# EasyEDA Pro project ProPrj_遥控_2025-12-06.epro, board NRF无线模块
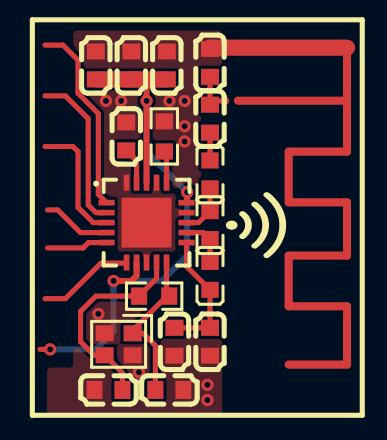
[diagram p7: board, top side]
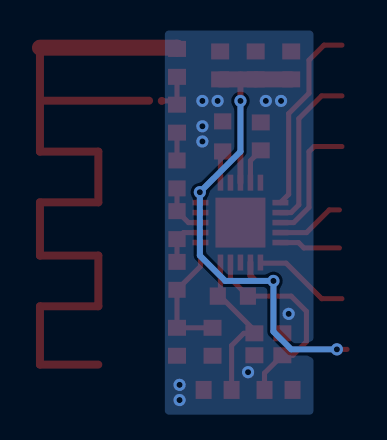
[diagram p8: board, bottom side, seen from below]

No outline. copper layers: Top Layer, Bottom Layer. Coordinates in mm from the lowest, leftmost part position.
Stack: Top Layer 0.035mm / Dielectric1 1.51mm FR4 er 4.5 / Bottom Layer 0.035mm

## Design rules (mm)
template: 用户自定义配置
spacing Default (default): track to track 0.152, other pairs 0 to 0.152
track width Default (default): min 0.254, default 0.254, max 25.4
differential pair differentialPair (default): width min 0.127, default 0.254, max 2.54; gap min 0.152, default 0.152
via Default (default): diameter min 0.61, default 0.61, max 100.025; hole min 0.305, default 0.305, max 59.995
pour e9 uses gge5322
pour e112 uses gge5322(1)

## Placement (name value [footprint] x y rotation side)
C36  22pF  [C0603]  0.63 0 0 top
C37  22pF  [C0603]  3.68 0 180 top
C38  1.5pF  [C0603]  5.72 13.59 90 top
C39  1pF  [C0603]  5.72 16.38 270 top
C40  33nF  [C0603]  1.52 12.7 90 top
C41  100nF  [C0603]  1.78 16.26 270 top
C42  100nF  [C0603]  0 16.26 270 top
C43  1uF  [C0603]  3.56 16.26 270 top
C44  2.2nF  [C0603]  3.94 2.41 90 top
C45  4.7pF  [C0603]  5.72 2.41 90 top
L3  3.9nH  [L0603]  5.72 10.8 90 top
L4  8.2nH  [L0603]  5.72 8.26 270 top
L5  2.7nH  [L0603]  5.72 5.72 270 top
NOREF  -  [Pad_e111]  6.48 14.48 90 top
R41  22kΩ  [R0603]  3.43 12.7 90 top
R42  1MΩ  [R0603]  2.92 4.7 180 top
U13  NRF24L01P-R  [QFN-20_L4.0-W4.0-P0.50-BL-EP]  2.54 8.38 270 top
X1  16MHz  [CRYSTAL-SMD_4P-L2.0-W1.6-BL]  1.14 2.29 180 top

## Footprints (pads in the part's own frame, mm; a bottom-side part is the same pattern mirrored in y, then rotated)
C0603
  rect 0.8x0.9 smd: 1(-0.7,0) 2(0.7,0)
CRYSTAL-SMD_4P-L2.0-W1.6-BL
  rect 0.9x0.8 smd: 1(-0.7,-0.55) 2(0.7,-0.55) 3(0.7,0.55) 4(-0.7,0.55)
L0603
  rect 0.8x0.864 smd: 1(-0.7,0) 2(0.7,0)
Pad_e111
  round 0.4 smd: 2(0,0)
QFN-20_L4.0-W4.0-P0.50-BL-EP
  rect 0.28x0.8 smd: 1(-1,-2) 2(-0.5,-2) 3(0,-2) 4(0.5,-2) 5(1,-2) 11(1,2) 12(0.5,2) 13(0,2) 14(-0.5,2) 15(-1,2)
  rect 0.8x0.28 smd: 6(2,-1) 7(2,-0.5) 8(2,0) 9(2,0.5) 10(2,1) 16(-2,1) 17(-2,0.5) 18(-2,0) 19(-2,-0.5) 20(-2,-1)
  rect 2.5x2.5 smd: 21(0,0)
R0603
  rect 0.806x0.864 smd: 1(-0.753,0) 2(0.753,0)

## Nets
As in the schematic, except:
$1N3907: C38.2 C39.2 NOREF.2

## Via types
v1: diameter 0.61, hole 0.305, Top Layer to Bottom Layer, 14 vias

## Routing (per net, layer and track width the routed paths; a pad name or vN(x,y) marks a point on that pad's centre or on a via; arc(x,y) is an arc through that point)
3V3: length 30.6
  Top Layer w0.254: v1(-2.29,2.03) -2.79,2.03
  Top Layer w0.3: v1(4.57,9.91) 4.57,9.38 4.54,9.38 ; U13.18 v1(2.54,14.48) 2.54,15.56 ; 2.04,6.38 2.04,5.72 1.78,5.46 v1(0.89,5.46)
  Top Layer w0.8: C42.2 C41.2 C43.2
  Bottom Layer w0.3: v1(2.54,14.48) 2.54,11.94 v1(4.57,9.91) 4.57,6.73 3.3,5.46 v1(0.89,5.46) 0.89,2.92 0,2.03 v1(-2.29,2.03)
GND: length 42.9
  Top Layer w0.4: 9.65,1.27 12.57,1.27 12.57,4.19 9.65,4.19 9.65,6.73 12.57,6.73 12.57,9.4 9.65,9.4 9.65,11.94 12.57,11.94 12.57,14.49 ; 12.57,14.49 7.11,14.49 ; 12.57,14.49 12.57,17.15
  Top Layer w0.8: 12.57,17.15 5.72,17.15 C39.1
  vias: v1(0.13,3.81) v1(0.51,14.48) v1(1.27,14.48) v1(2.16,0.89) v1(3.68,14.48) v1(4.44,14.48) v1(4.44,13.21) v1(4.44,12.45) v1(5.59,0.25) v1(5.59,-0.51)
CE: length 9.7
  Top Layer w0.254: 0.54,9.38 0.13,9.8 0.13,13.84 -0.89,14.86 -0.89,16.52 -1.64,17.27 -2.54,17.27
CSN: length 8
  Top Layer w0.254: -2.54,14.73 -1.52,14.73 -0.38,13.59 -0.38,9.27 0.01,8.88 0.54,8.88
IRQ: length 4.8
  Top Layer w0.254: 1.54,6.38 1.51,6.35 0.25,6.35 -1.52,4.57 -2.54,4.57
MISO: length 3.1
  Top Layer w0.254: 0.54,7.38 -0.37,7.38 -0.63,7.11 -2.41,7.11
MOSI: length 3.4
  Top Layer w0.254: -2.41,9.02 -1.91,9.02 -0.77,7.88 0.54,7.88
SCK: length 6.3
  Top Layer w0.254: 0.54,8.38 -0.13,8.38 -0.89,9.14 -0.89,11.94 -1.14,12.19 -2.54,12.19
$1N3893: length 2.6
  Top Layer w0.254: 5.72,10.09 5.72,8.96 5.14,8.38 U13.13
$1N3894: length 2.4
  Top Layer w0.254: U13.12 5.39,7.88 5.72,7.55 5.72,6.42
$1N3895: length 6.5
  Top Layer w0.254: U13.11 4.54,6.19 5.72,5.01 C45.2 C44.2
$1N3896: length 10.4
  Top Layer w0.254: 3.04,6.38 3.04,5.58 2.17,4.71 R42.2 0,4.7 -0.76,3.94 -0.76,2.41 -0.08,1.74 0.44,1.74 1.34,0.84 C36.2
$1N3897: length 8
  Top Layer w0.254: C37.2 2.98,2.23 2.37,2.84 1.84,2.84 1.84,2.99 3.56,4.7 R42.1 3.54,4.83 3.54,6.38
$1N3900: length 1.6
  Top Layer w0.254: 3.54,10.38 3.54,11.84 3.43,11.95
$1N3902: length 1.8
  Top Layer w0.254: U13.19 2.04,11.48 1.52,12
$1N3906: length 1.4
  Top Layer w0.254: C38.1 5.72,11.5
$1N3907: length 2.2
  Top Layer w0.254: 5.72,14.48 5.72,15.68 ; 5.72,14.48 C38.2 ; 5.72,14.48 NOREF.2

## Copper pours and planes (outline as drawn; the poured copper is in the pictures)
GND on Top Layer: 6.22,20.07 6.22,-2.92 6.1,-2.79 -9.27,-2.79 -8.13,-1.65 -8.13,24
GND on Bottom Layer: 6.22,19.56 6.22,-3.43 6.1,-3.3 -9.27,-3.3 -1.02,-2.41 -1.02,18.16
